# Altium project PRLIB.PrjPcb
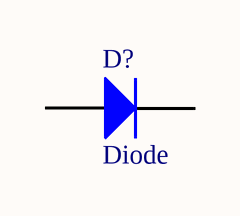
[diagram p0: My_lib.SchDoc]
1 sheet, 1 parts. Net scope: global (net labels, ports and power ports of the same name join across sheets).

## Sheet My_lib.SchDoc
size A4

### Parts
D?  Diode  [DSO-C2/X3.3]

### Nets

Not connected (* = marked no-connect by the designer): D? 1(A) 2(K)

### Library data of the parts
D? = Diode: Default Diode; Published: 8-Jun-2000; LatestRevisionDate: 17-Jul-2002; LatestRevisionNote: Re-released for DXP Platform.; PackageVersion: Sep-1996; PackageReference: SMC; Publisher: Altium Limited; Code_JEDEC: DO-214-AB